# Altium schematic sheet FPGA.SchDoc
size A4; SheetNumber: 7; SheetTotal: 14
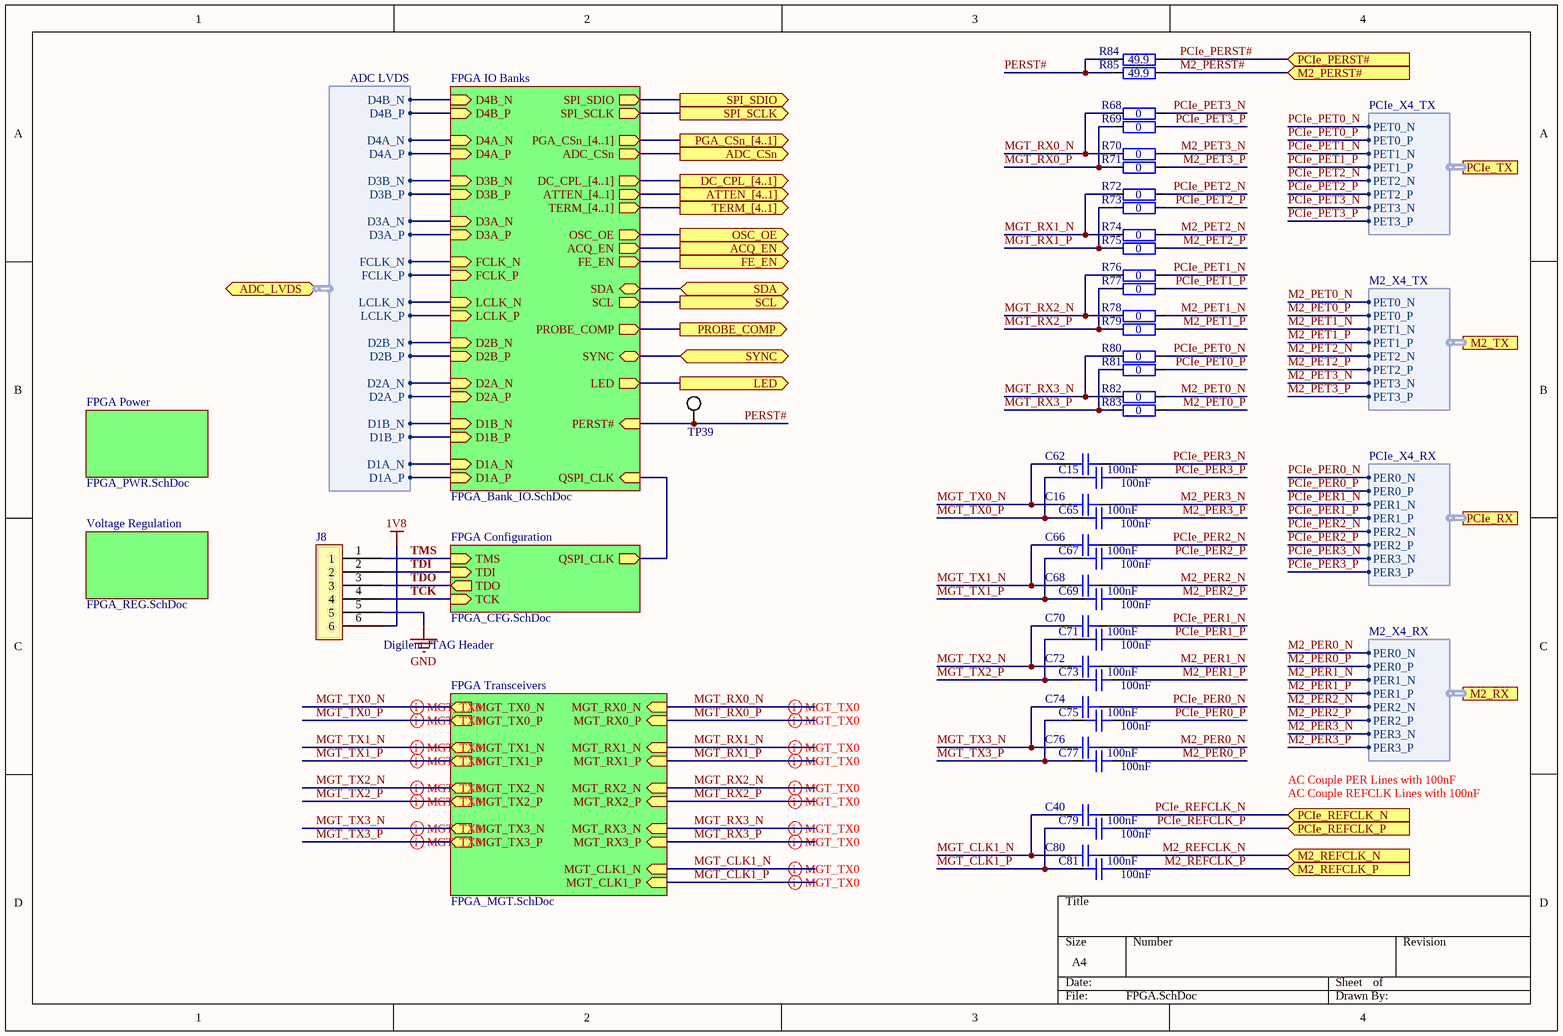
[diagram p0: FPGA.SchDoc]

## Parts
C15  100nF  [GEN_C_0201]
C16  100nF  [GEN_C_0201]
C40  100nF  [GEN_C_0201]
C62  100nF  [GEN_C_0201]
C65  100nF  [GEN_C_0201]
C66  100nF  [GEN_C_0201]
C67  100nF  [GEN_C_0201]
C68  100nF  [GEN_C_0201]
C69  100nF  [GEN_C_0201]
C70  100nF  [GEN_C_0201]
C71  100nF  [GEN_C_0201]
C72  100nF  [GEN_C_0201]
C73  100nF  [GEN_C_0201]
C74  100nF  [GEN_C_0201]
C75  100nF  [GEN_C_0201]
C76  100nF  [GEN_C_0201]
C77  100nF  [GEN_C_0201]
C79  100nF  [GEN_C_0201]
C80  100nF  [GEN_C_0201]
C81  100nF  [GEN_C_0201]
J8  2.54mm 6 Pin TH  [GEN_2.54mm_6_Pin_TH_RA]  (value not drawn)
R68  0  [GEN_R_0201]
R69  0  [GEN_R_0201]
R70  0  [GEN_R_0201]
R71  0  [GEN_R_0201]
R72  0  [GEN_R_0201]
R73  0  [GEN_R_0201]
R74  0  [GEN_R_0201]
R75  0  [GEN_R_0201]
R76  0  [GEN_R_0201]
R77  0  [GEN_R_0201]
R78  0  [GEN_R_0201]
R79  0  [GEN_R_0201]
R80  0  [GEN_R_0201]
R81  0  [GEN_R_0201]
R82  0  [GEN_R_0201]
R83  0  [GEN_R_0201]
R84  49.9  [GEN_R_0402]
R85  49.9  [GEN_R_0402]
TP39  PCB  [GEN_TP_PCB]  (value not drawn)  (no BOM)

## Sub-sheets
FPGA Configuration = FPGA_CFG.SchDoc: TDI (in), TDO (out), TCK (in), TMS (in), QSPI_CLK (out)
FPGA IO Banks = FPGA_Bank_IO.SchDoc: LCLK_P (in), LCLK_N (in), FCLK_P (in), FCLK_N (in), D1B_P (in), D1B_N (in), D3B_N (in), D3B_P (in), D1A_P (in), D1A_N (in), D4A_N (in), D4A_P (in), D3A_P (in), D3A_N (in), D4B_N (in), D4B_P (in), D2A_N (in), D2A_P (in), D2B_N (in), D2B_P (in), SPI_SDIO (out), SYNC (bidir), SPI_SCLK (out), PROBE_COMP (out), OSC_OE (out), ACQ_EN (out), FE_EN (out), SDA (bidir), SCL (out), ADC_CSn (out), PERST# (in), DC_CPL_[4..1] (out), ATTEN_[4..1] (out), PGA_CSn_[4..1] (out), TERM_[4..1] (out), LED (out), QSPI_CLK (in)
FPGA Power = FPGA_PWR.SchDoc: no entries
FPGA Transceivers = FPGA_MGT.SchDoc: MGT_TX3_N (out), MGT_TX2_N (out), MGT_TX1_N (out), MGT_TX0_N (out), MGT_TX3_P (out), MGT_TX2_P (out), MGT_TX1_P (out), MGT_TX0_P (out), MGT_RX3_N (in), MGT_RX3_P (in), MGT_RX2_N (in), MGT_RX2_P (in), MGT_RX1_N (in), MGT_RX1_P (in), MGT_RX0_N (in), MGT_RX0_P (in), MGT_CLK1_N (in), MGT_CLK1_P (in)
Voltage Regulation = FPGA_REG.SchDoc: no entries

## Ports
ACQ_EN (out), ADC_CSn (out), ADC_LVDS (bidir, harness ADC LVDS), ATTEN_[4..1] (out), DC_CPL_[4..1] (out), FE_EN (out), LED (out), M2_PERST# (in), M2_REFCLK_N (in), M2_REFCLK_P (in), M2_RX (harness M2_X4_RX), M2_TX (harness M2_X4_TX), OSC_OE (out), PCIe_PERST# (in), PCIe_REFCLK_N (in), PCIe_REFCLK_P (in), PCIe_RX (harness PCIe_X4_RX), PCIe_TX (harness PCIe_X4_TX), PGA_CSn_[4..1] (out), PROBE_COMP (out), SCL (out), SDA (bidir), SPI_SCLK (out), SPI_SDIO (out), SYNC (bidir), TERM_[4..1] (out)

## Harnesses
PCIe_X4_RX: PER0_N, PER0_P, PER1_N, PER1_P, PER2_N, PER2_P, PER3_N, PER3_P
PCIe_X4_TX: PET0_N, PET0_P, PET1_N, PET1_P, PET2_N, PET2_P, PET3_N, PET3_P
M2_X4_RX: PER0_N, PER0_P, PER1_N, PER1_P, PER2_N, PER2_P, PER3_N, PER3_P
M2_X4_TX: PET0_N, PET0_P, PET1_N, PET1_P, PET2_N, PET2_P, PET3_N, PET3_P
ADC LVDS: D4B_N, D4B_P, D4A_N, D4A_P, D3B_N, D3B_P, D3A_N, D3A_P, FCLK_N, FCLK_P, LCLK_N, LCLK_P, D2B_N, D2B_P, D2A_N, D2A_P, D1B_N, D1B_P, D1A_N, D1A_P

## Nets
1V8: J8.6
GND: J8.5
ACQ_EN: port ACQ_EN, sheet FPGA IO Banks/ACQ_EN
ADC_CSn: port ADC_CSn, sheet FPGA IO Banks/ADC_CSn
FE_EN: port FE_EN, sheet FPGA IO Banks/FE_EN
LED: port LED, sheet FPGA IO Banks/LED
M2_PER0_N: C76.1 ; port M2_RX.PER0_N
M2_PER0_P: C77.1 ; port M2_RX.PER0_P
M2_PER1_N: C72.1 ; port M2_RX.PER1_N
M2_PER1_P: C73.1 ; port M2_RX.PER1_P
M2_PER2_N: C68.1 ; port M2_RX.PER2_N
M2_PER2_P: C69.1 ; port M2_RX.PER2_P
M2_PER3_N: C16.1 ; port M2_RX.PER3_N
M2_PER3_P: C65.1 ; port M2_RX.PER3_P
M2_PERST#: R85.2 ; port M2_PERST#
M2_PET0_N: R82.2 ; port M2_TX.PET0_N
M2_PET0_P: R83.2 ; port M2_TX.PET0_P
M2_PET1_N: R78.2 ; port M2_TX.PET1_N
M2_PET1_P: R79.2 ; port M2_TX.PET1_P
M2_PET2_N: R74.2 ; port M2_TX.PET2_N
M2_PET2_P: R75.2 ; port M2_TX.PET2_P
M2_PET3_N: R70.2 ; port M2_TX.PET3_N
M2_PET3_P: R71.2 ; port M2_TX.PET3_P
M2_REFCLK_N: C80.1 ; port M2_REFCLK_N
M2_REFCLK_P: C81.1 ; port M2_REFCLK_P
MGT_CLK1_N: C40.2 C80.2 ; sheet FPGA Transceivers/MGT_CLK1_N
MGT_CLK1_P: C79.2 C81.2 ; sheet FPGA Transceivers/MGT_CLK1_P
MGT_RX0_N: R68.1 R70.1 ; sheet FPGA Transceivers/MGT_RX0_N
MGT_RX0_P: R69.1 R71.1 ; sheet FPGA Transceivers/MGT_RX0_P
MGT_RX1_N: R72.1 R74.1 ; sheet FPGA Transceivers/MGT_RX1_N
MGT_RX1_P: R73.1 R75.1 ; sheet FPGA Transceivers/MGT_RX1_P
MGT_RX2_N: R76.1 R78.1 ; sheet FPGA Transceivers/MGT_RX2_N
MGT_RX2_P: R77.1 R79.1 ; sheet FPGA Transceivers/MGT_RX2_P
MGT_RX3_N: R80.1 R82.1 ; sheet FPGA Transceivers/MGT_RX3_N
MGT_RX3_P: R81.1 R83.1 ; sheet FPGA Transceivers/MGT_RX3_P
MGT_TX0_N: C16.2 C62.2 ; sheet FPGA Transceivers/MGT_TX0_N
MGT_TX0_P: C15.2 C65.2 ; sheet FPGA Transceivers/MGT_TX0_P
MGT_TX1_N: C66.2 C68.2 ; sheet FPGA Transceivers/MGT_TX1_N
MGT_TX1_P: C67.2 C69.2 ; sheet FPGA Transceivers/MGT_TX1_P
MGT_TX2_N: C70.2 C72.2 ; sheet FPGA Transceivers/MGT_TX2_N
MGT_TX2_P: C71.2 C73.2 ; sheet FPGA Transceivers/MGT_TX2_P
MGT_TX3_N: C74.2 C76.2 ; sheet FPGA Transceivers/MGT_TX3_N
MGT_TX3_P: C75.2 C77.2 ; sheet FPGA Transceivers/MGT_TX3_P
OSC_OE: port OSC_OE, sheet FPGA IO Banks/OSC_OE
PCIe_PER0_N: C74.1 ; port PCIe_RX.PER0_N
PCIe_PER0_P: C75.1 ; port PCIe_RX.PER0_P
PCIe_PER1_N: C70.1 ; port PCIe_RX.PER1_N
PCIe_PER1_P: C71.1 ; port PCIe_RX.PER1_P
PCIe_PER2_N: C66.1 ; port PCIe_RX.PER2_N
PCIe_PER2_P: C67.1 ; port PCIe_RX.PER2_P
PCIe_PER3_N: C62.1 ; port PCIe_RX.PER3_N
PCIe_PER3_P: C15.1 ; port PCIe_RX.PER3_P
PCIe_PERST#: R84.2 ; port PCIe_PERST#
PCIe_PET0_N: R80.2 ; port PCIe_TX.PET0_N
PCIe_PET0_P: R81.2 ; port PCIe_TX.PET0_P
PCIe_PET1_N: R76.2 ; port PCIe_TX.PET1_N
PCIe_PET1_P: R77.2 ; port PCIe_TX.PET1_P
PCIe_PET2_N: R72.2 ; port PCIe_TX.PET2_N
PCIe_PET2_P: R73.2 ; port PCIe_TX.PET2_P
PCIe_PET3_N: R68.2 ; port PCIe_TX.PET3_N
PCIe_PET3_P: R69.2 ; port PCIe_TX.PET3_P
PCIe_REFCLK_N: C40.1 ; port PCIe_REFCLK_N
PCIe_REFCLK_P: C79.1 ; port PCIe_REFCLK_P
PERST#: R84.1 R85.1 TP39.1 ; sheet FPGA IO Banks/PERST#
PROBE_COMP: port PROBE_COMP, sheet FPGA IO Banks/PROBE_COMP
SCL: port SCL, sheet FPGA IO Banks/SCL
SDA: port SDA, sheet FPGA IO Banks/SDA
SPI_SCLK: port SPI_SCLK, sheet FPGA IO Banks/SPI_SCLK
SPI_SDIO: port SPI_SDIO, sheet FPGA IO Banks/SPI_SDIO
SYNC: port SYNC, sheet FPGA IO Banks/SYNC
TCK: J8.4 ; sheet FPGA Configuration/TCK
TDI: J8.2 ; sheet FPGA Configuration/TDI
TDO: J8.3 ; sheet FPGA Configuration/TDO
TMS: J8.1 ; sheet FPGA Configuration/TMS
(unnamed): sheet FPGA IO Banks/LCLK_P, port ADC_LVDS.LCLK_P
(unnamed): sheet FPGA IO Banks/LCLK_N, port ADC_LVDS.LCLK_N
(unnamed): sheet FPGA IO Banks/FCLK_P, port ADC_LVDS.FCLK_P
(unnamed): sheet FPGA IO Banks/FCLK_N, port ADC_LVDS.FCLK_N
(unnamed): sheet FPGA IO Banks/D1B_P, port ADC_LVDS.D1B_P
(unnamed): sheet FPGA IO Banks/D1B_N, port ADC_LVDS.D1B_N
(unnamed): sheet FPGA IO Banks/D3B_N, port ADC_LVDS.D3B_N
(unnamed): sheet FPGA IO Banks/D3B_P, port ADC_LVDS.D3B_P
(unnamed): sheet FPGA IO Banks/D1A_P, port ADC_LVDS.D1A_P
(unnamed): sheet FPGA IO Banks/D1A_N, port ADC_LVDS.D1A_N
(unnamed): sheet FPGA IO Banks/D4A_N, port ADC_LVDS.D4A_N
(unnamed): sheet FPGA IO Banks/D4A_P, port ADC_LVDS.D4A_P
(unnamed): sheet FPGA IO Banks/D3A_P, port ADC_LVDS.D3A_P
(unnamed): sheet FPGA IO Banks/D3A_N, port ADC_LVDS.D3A_N
(unnamed): sheet FPGA IO Banks/D4B_N, port ADC_LVDS.D4B_N
(unnamed): sheet FPGA IO Banks/D4B_P, port ADC_LVDS.D4B_P
(unnamed): sheet FPGA IO Banks/D2A_N, port ADC_LVDS.D2A_N
(unnamed): sheet FPGA IO Banks/D2A_P, port ADC_LVDS.D2A_P
(unnamed): sheet FPGA IO Banks/D2B_N, port ADC_LVDS.D2B_N
(unnamed): sheet FPGA IO Banks/D2B_P, port ADC_LVDS.D2B_P
(unnamed): sheet FPGA IO Banks/QSPI_CLK, sheet FPGA Configuration/QSPI_CLK

## Buses and harness runs
bus port ATTEN_[4..1] = sheet FPGA IO Banks/ATTEN_[4..1]
bus port DC_CPL_[4..1] = sheet FPGA IO Banks/DC_CPL_[4..1]
bus port PGA_CSn_[4..1] = sheet FPGA IO Banks/PGA_CSn_[4..1]
bus port TERM_[4..1] = sheet FPGA IO Banks/TERM_[4..1]

## Layout directives
differential pair; differential pair class PCIe: MGT_CLK1_N, MGT_CLK1_P, MGT_RX0_N, MGT_RX0_P, MGT_RX1_N, MGT_RX1_P, MGT_RX2_N, MGT_RX2_P, MGT_RX3_N, MGT_RX3_P, MGT_TX0_N, MGT_TX0_P, MGT_TX1_N, MGT_TX1_P, MGT_TX2_N, MGT_TX2_P, MGT_TX3_N, MGT_TX3_P

## Notes on the sheet
- (near J8) Digilent JTAG Header
- AC Couple PER Lines with 100nF
- AC Couple REFCLK Lines with 100nF

## Library data of the parts
C15 C16 C40 C62 C65-C77 C79-C81 = CAP 100nF 6.3V X5R 0201: House Part Number: C-100nF-0201-002; Manufacturer: Murata; Manufacturer Part Number: GRM033R60J104KE19D; Voltage Rating: 6.3V; Package: 0201; Supplier 1: Mouser; Supplier Part Number 1: 81-GRM033R60J104KE19; Value: 100nF
J8 = CONN 2.54mm 6 Pin TH RA: Manufacturer: Wurth Electronics; Manufacturer Part Number: 61300611021; Supplier 1: Mouser; Supplier Part Number 1: 710-61300611021
R68-R83 = RES 0 OHM 1% 1/20W 0201: Manufacturer: Stackpole Electronics; Manufacturer Part Number: RMCF0201ZT0R00; Tolerance: 1%; Package: 0201; Supplier 1: Mouser; Supplier Part Number 1: 708-RMCF0201ZT0R00; Value: 0
R84 R85 = RES 49.9 OHM 1% 1/10W 0402: Manufacturer: Yageo; Manufacturer Part Number: RC0402FR-0749R9L; Tolerance: 1%; Package: 0402; Supplier 1: Mouser; Supplier Part Number 1: 603-RC0402FR-0749R9L; Value: 49.9
TP39 = TP PCB 1mm